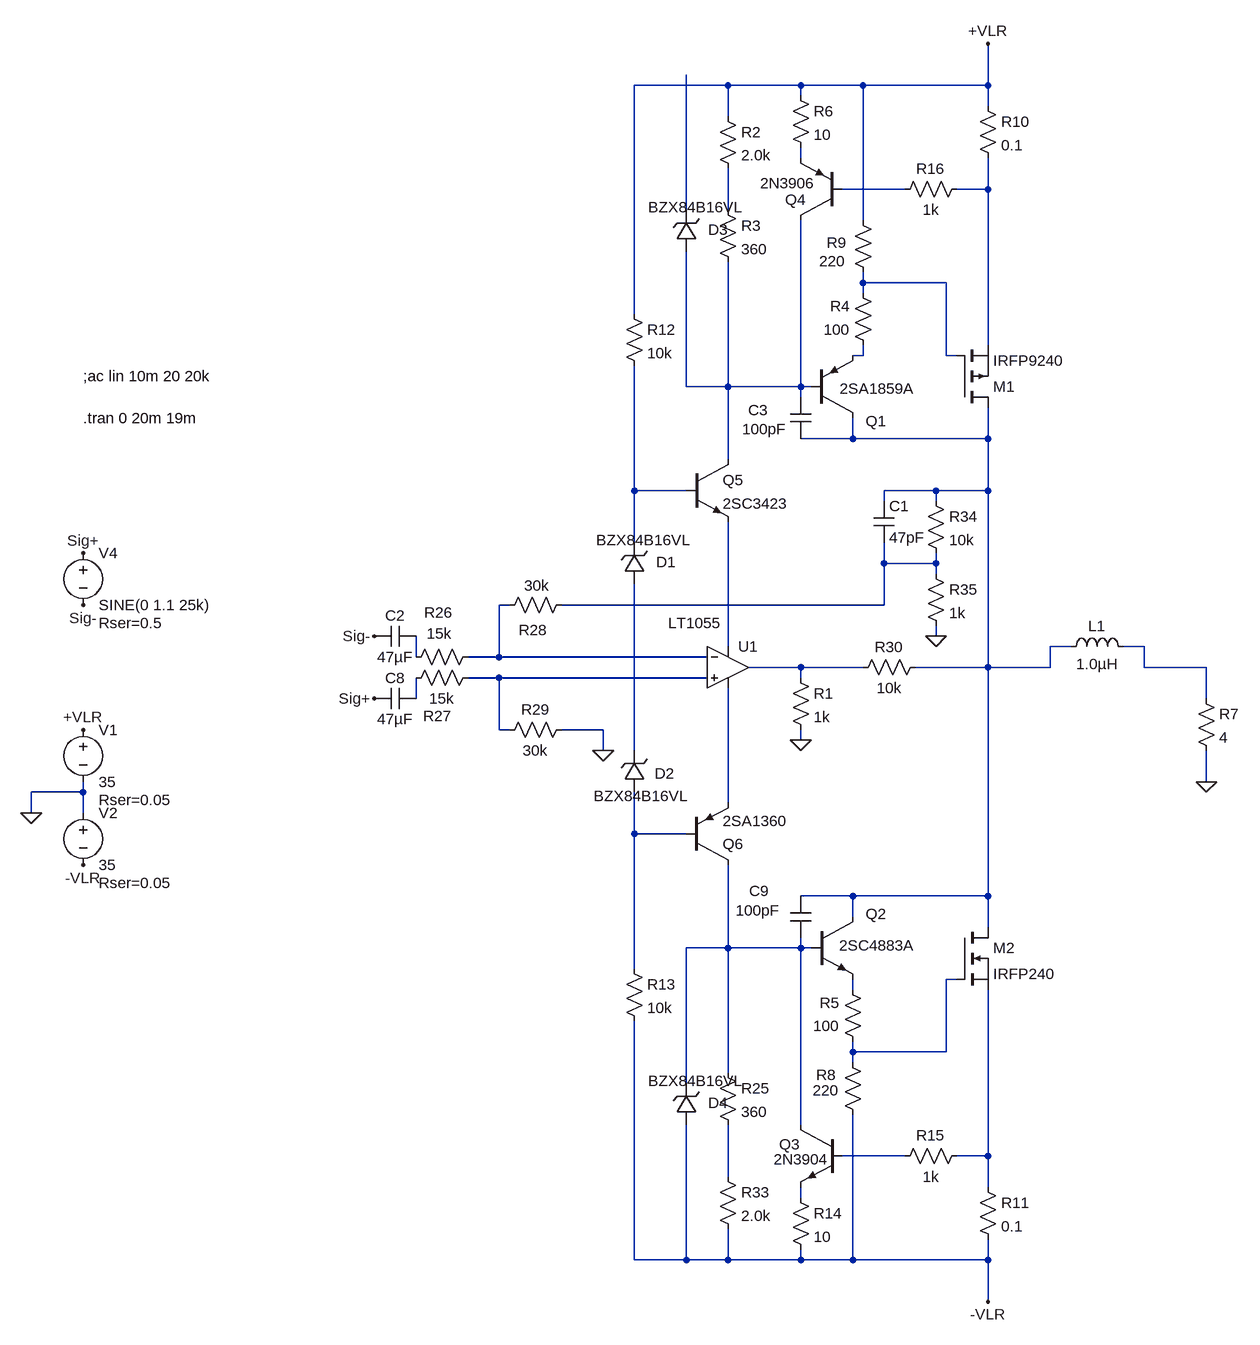
[diagram p0: schematic Feek FET Amp Final Low Power.asc]
Feek FET Amp Final Low Power.asc, the LTspice schematic file:
Version 4
SHEET 1 5268 2212
WIRE -1472 240 -1616 240
WIRE -1360 240 -1472 240
WIRE -1264 240 -1360 240
WIRE -1072 240 -1072 176
WIRE -1072 240 -1264 240
WIRE -1360 256 -1360 240
WIRE -1072 272 -1072 240
WIRE -1472 288 -1472 240
WIRE -1360 352 -1360 336
WIRE -1200 400 -1296 400
WIRE -1072 400 -1072 352
WIRE -1072 400 -1120 400
WIRE -1536 432 -1536 224
WIRE -1472 432 -1472 368
WIRE -1264 448 -1264 240
WIRE -1264 544 -1264 528
WIRE -1136 544 -1264 544
WIRE -1264 560 -1264 544
WIRE -1616 592 -1616 240
WIRE -1072 640 -1072 400
WIRE -1264 656 -1264 640
WIRE -1264 656 -1280 656
WIRE -1136 656 -1136 544
WIRE -1120 656 -1136 656
WIRE -1536 704 -1536 496
WIRE -1472 704 -1472 512
WIRE -1472 704 -1536 704
WIRE -1360 704 -1360 448
WIRE -1360 704 -1472 704
WIRE -1344 704 -1360 704
WIRE -1360 720 -1360 704
WIRE -1280 784 -1280 752
WIRE -1280 784 -1360 784
WIRE -1072 784 -1072 736
WIRE -1072 784 -1280 784
WIRE -1472 816 -1472 704
WIRE -1616 864 -1616 672
WIRE -1536 864 -1616 864
WIRE -1152 864 -1232 864
WIRE -1072 864 -1072 784
WIRE -1072 864 -1152 864
WIRE -1232 880 -1232 864
WIRE -1152 880 -1152 864
WIRE -1616 944 -1616 864
WIRE -1232 976 -1232 944
WIRE -1152 976 -1152 960
WIRE -1152 976 -1232 976
WIRE -1152 992 -1152 976
WIRE -1808 1040 -1824 1040
WIRE -1232 1040 -1232 976
WIRE -1232 1040 -1728 1040
WIRE -1152 1088 -1152 1072
WIRE -1472 1104 -1472 912
WIRE -944 1104 -976 1104
WIRE -832 1104 -864 1104
WIRE -1952 1120 -1952 1088
WIRE -1824 1120 -1824 1040
WIRE -1824 1120 -1872 1120
WIRE -1504 1120 -1824 1120
WIRE -1360 1136 -1440 1136
WIRE -1264 1136 -1360 1136
WIRE -1072 1136 -1072 864
WIRE -1072 1136 -1184 1136
WIRE -976 1136 -976 1104
WIRE -976 1136 -1072 1136
WIRE -832 1136 -832 1104
WIRE -736 1136 -832 1136
WIRE -1824 1152 -1872 1152
WIRE -1504 1152 -1824 1152
WIRE -1360 1152 -1360 1136
WIRE -1952 1184 -1952 1152
WIRE -736 1184 -736 1136
WIRE -1824 1232 -1824 1152
WIRE -1808 1232 -1824 1232
WIRE -1664 1232 -1728 1232
WIRE -1360 1248 -1360 1232
WIRE -1664 1264 -1664 1232
WIRE -1616 1264 -1616 1008
WIRE -736 1312 -736 1264
WIRE -2464 1328 -2464 1312
WIRE -2464 1328 -2544 1328
WIRE -1472 1344 -1472 1168
WIRE -2544 1360 -2544 1328
WIRE -2464 1360 -2464 1328
WIRE -1616 1392 -1616 1328
WIRE -1536 1392 -1616 1392
WIRE -1280 1488 -1360 1488
WIRE -1072 1488 -1072 1136
WIRE -1072 1488 -1280 1488
WIRE -1280 1520 -1280 1488
WIRE -1072 1536 -1072 1488
WIRE -1472 1568 -1472 1440
WIRE -1472 1568 -1536 1568
WIRE -1360 1568 -1360 1552
WIRE -1360 1568 -1472 1568
WIRE -1344 1568 -1360 1568
WIRE -1616 1600 -1616 1392
WIRE -1120 1616 -1136 1616
WIRE -1280 1632 -1280 1616
WIRE -1280 1728 -1280 1712
WIRE -1136 1728 -1136 1616
WIRE -1136 1728 -1280 1728
WIRE -1280 1744 -1280 1728
WIRE -1472 1760 -1472 1568
WIRE -1536 1776 -1536 1568
WIRE -1360 1840 -1360 1568
WIRE -1200 1888 -1296 1888
WIRE -1072 1888 -1072 1632
WIRE -1072 1888 -1120 1888
WIRE -1472 1920 -1472 1840
WIRE -1072 1936 -1072 1888
WIRE -1360 1952 -1360 1936
WIRE -1616 2048 -1616 1680
WIRE -1536 2048 -1536 1840
WIRE -1536 2048 -1616 2048
WIRE -1472 2048 -1472 2000
WIRE -1472 2048 -1536 2048
WIRE -1360 2048 -1360 2032
WIRE -1360 2048 -1472 2048
WIRE -1280 2048 -1280 1824
WIRE -1280 2048 -1360 2048
WIRE -1072 2048 -1072 2016
WIRE -1072 2048 -1280 2048
WIRE -1072 2112 -1072 2048
FLAG -736 1312 0
FLAG -2464 960 Sig+
FLAG -2464 1040 Sig-
FLAG -2464 1232 +VLR
FLAG -2464 1440 -VLR
FLAG -1664 1264 0
FLAG -2016 1088 Sig-
FLAG -2016 1184 Sig+
FLAG -1072 176 +VLR
FLAG -1072 2112 -VLR
FLAG -2544 1360 0
FLAG -1360 1248 0
FLAG -1152 1088 0
SYMBOL OpAmps\\LT1055 -1472 1072 R0
WINDOW 3 -92 -4 Left 2
SYMATTR InstName U1
SYMBOL pmos -1120 736 M180
SYMATTR InstName M1
SYMATTR Value IRFP9240
SYMBOL nmos -1120 1536 R0
SYMATTR InstName M2
SYMATTR Value IRFP240
SYMBOL res -752 1168 R0
SYMATTR InstName R7
SYMATTR Value 4
SYMBOL res -1088 256 R0
SYMATTR InstName R10
SYMATTR Value 0.1
SYMBOL res -1088 1920 R0
SYMATTR InstName R11
SYMATTR Value 0.1
SYMBOL npn -1536 816 R0
SYMATTR InstName Q5
SYMATTR Value 2SC3423
SYMBOL pnp -1536 1440 M180
SYMATTR InstName Q6
SYMATTR Value 2SA1360
SYMBOL zener -1600 1008 R180
WINDOW 0 -48 34 Left 2
WINDOW 3 -71 68 Left 2
SYMATTR InstName D1
SYMATTR Value BZX84B16VL
SYMBOL zener -1600 1328 R180
WINDOW 0 -46 29 Left 2
WINDOW 3 -67 -6 Left 2
SYMATTR InstName D2
SYMATTR Value BZX84B16VL
SYMBOL res -1632 576 R0
SYMATTR InstName R12
SYMATTR Value 10k
SYMBOL res -1632 1584 R0
SYMATTR InstName R13
SYMATTR Value 10k
SYMBOL pnp -1344 752 M180
WINDOW 0 84 -5 Left 2
WINDOW 3 44 45 Left 2
SYMATTR InstName Q1
SYMATTR Value 2SA1859A
SYMBOL npn -1344 1520 R0
WINDOW 0 84 -5 Left 2
WINDOW 3 43 44 Left 2
SYMATTR InstName Q2
SYMATTR Value 2SC4883A
SYMBOL res -1280 432 R0
WINDOW 0 -40 50 Left 2
WINDOW 3 -52 79 Left 2
SYMATTR InstName R9
SYMATTR Value 220
SYMBOL res -1296 1728 R0
WINDOW 0 -40 35 Left 2
WINDOW 3 -46 59 Left 2
SYMATTR InstName R8
SYMATTR Value 220
SYMBOL npn -1296 1840 M0
WINDOW 0 65 30 Left 2
WINDOW 3 21 53 Left 2
SYMATTR InstName Q3
SYMATTR Value 2N3904
SYMBOL res -1104 1872 R90
WINDOW 0 0 56 VBottom 2
WINDOW 3 32 56 VTop 2
SYMATTR InstName R15
SYMATTR Value 1k
SYMBOL pnp -1296 448 R180
WINDOW 3 42 57 Left 2
SYMATTR Value 2N3906
SYMATTR InstName Q4
SYMBOL res -1104 384 R90
WINDOW 0 0 56 VBottom 2
WINDOW 3 32 56 VTop 2
SYMATTR InstName R16
SYMATTR Value 1k
SYMBOL ind -960 1120 R270
WINDOW 0 32 56 VTop 2
WINDOW 3 5 56 VBottom 2
SYMATTR InstName L1
SYMATTR Value 1.0µH
SYMBOL voltage -2464 944 R0
WINDOW 39 24 124 Left 2
SYMATTR SpiceLine Rser=0.5
SYMATTR Value2 AC 1.0 0
SYMATTR InstName V4
SYMATTR Value SINE(0 1.1 25k)
SYMBOL res -1856 1104 R90
WINDOW 0 -37 61 VBottom 2
WINDOW 3 -36 60 VTop 2
SYMATTR InstName R26
SYMATTR Value 15k
SYMATTR SpiceLine tol=1
SYMBOL res -1856 1136 R90
WINDOW 0 90 63 VBottom 2
WINDOW 3 32 56 VTop 2
SYMATTR InstName R27
SYMATTR Value 15k
SYMATTR SpiceLine tol=1
SYMBOL res -1712 1024 R90
WINDOW 0 70 60 VBottom 2
WINDOW 3 -30 54 VTop 2
SYMATTR InstName R28
SYMATTR Value 30k
SYMATTR SpiceLine tol=1
SYMBOL res -1712 1216 R90
WINDOW 0 0 56 VBottom 2
WINDOW 3 32 56 VTop 2
SYMATTR InstName R29
SYMATTR Value 30k
SYMATTR SpiceLine tol=1
SYMBOL cap -1952 1072 R90
WINDOW 0 0 32 VBottom 2
WINDOW 3 32 32 VTop 2
SYMATTR InstName C2
SYMATTR Value 47µF
SYMBOL cap -1952 1168 R90
WINDOW 0 0 32 VBottom 2
WINDOW 3 32 32 VTop 2
SYMATTR InstName C8
SYMATTR Value 47µF
SYMBOL voltage -2464 1216 R0
WINDOW 123 0 0 Left 0
WINDOW 39 24 124 Left 2
SYMATTR SpiceLine Rser=0.05
SYMATTR InstName V1
SYMATTR Value 35
SYMBOL voltage -2464 1344 R0
WINDOW 123 0 0 Left 0
WINDOW 39 24 124 Left 2
SYMATTR SpiceLine Rser=0.05
SYMATTR InstName V2
SYMATTR Value 35
SYMBOL res -1488 272 R0
SYMATTR InstName R2
SYMATTR Value 2.0k
SYMBOL res -1488 1904 R0
SYMATTR InstName R33
SYMATTR Value 2.0k
SYMBOL res -1376 1136 R0
SYMATTR InstName R1
SYMATTR Value 1k
SYMBOL res -1168 864 R0
SYMATTR InstName R34
SYMATTR Value 10k
SYMBOL res -1168 976 R0
SYMATTR InstName R35
SYMATTR Value 1k
SYMBOL res -1248 656 R180
WINDOW 0 36 76 Left 2
WINDOW 3 36 40 Left 2
SYMATTR InstName R4
SYMATTR Value 100
SYMBOL res -1264 1728 R180
WINDOW 0 36 76 Left 2
WINDOW 3 36 40 Left 2
SYMATTR InstName R5
SYMATTR Value 100
SYMBOL res -1376 240 R0
SYMATTR InstName R6
SYMATTR Value 10
SYMBOL res -1376 1936 R0
SYMATTR InstName R14
SYMATTR Value 10
SYMBOL res -1488 416 R0
SYMATTR InstName R3
SYMATTR Value 360
SYMBOL res -1488 1744 R0
SYMATTR InstName R25
SYMATTR Value 360
SYMBOL res -1168 1120 R90
WINDOW 0 0 56 VBottom 2
WINDOW 3 32 56 VTop 2
SYMATTR InstName R30
SYMATTR Value 10k
SYMBOL cap -1248 880 R0
SYMATTR InstName C1
SYMATTR Value 47pF
SYMBOL cap -1376 720 R0
WINDOW 0 -65 20 Left 2
WINDOW 3 -74 49 Left 2
SYMATTR InstName C3
SYMATTR Value 100pF
SYMBOL cap -1376 1488 R0
WINDOW 0 -63 -8 Left 2
WINDOW 3 -84 22 Left 2
SYMATTR InstName C9
SYMATTR Value 100pF
SYMBOL zener -1520 496 R180
WINDOW 0 -48 34 Left 2
WINDOW 3 -71 68 Left 2
SYMATTR InstName D3
SYMATTR Value BZX84B16VL
SYMBOL zener -1520 1840 R180
WINDOW 0 -48 34 Left 2
WINDOW 3 -71 68 Left 2
SYMATTR InstName D4
SYMATTR Value BZX84B16VL
TEXT -2464 752 Left 2 !.tran 0 20m 19m
TEXT -2464 688 Left 2 !;ac lin 10m 20 20k

The netlist it stands for:
* Feek FET Amp Final Low Power.asc
XU1 N017 N012 N013 N020 N016 LT1055  ; pins In+ In- V+ V- OUT
M1 N009 N006 N003 N003 IRFP9240
M2 N009 N023 N026 N026 IRFP240
R7 N014 0 4
R10 +VLR N003 0.1
R11 N026 -VLR 0.1
Q5 N008 N010 N013 0 2SC3423
Q6 N022 N021 N020 0 2SA1360
D1 N019 N010 BZX84B16VL
D2 N021 N019 BZX84B16VL
R12 +VLR N010 10k
R13 N021 -VLR 10k
Q1 N009 N008 N007 0 2SA1859A
Q2 N009 N022 N024 0 2SC4883A
R9 +VLR N006 220
R8 N023 -VLR 220
Q3 N022 N025 N028 0 2N3904
R15 N026 N025 1k
Q4 N008 N002 N001 0 2N3906
R16 N003 N002 1k
L1 N009 N014 1.0µH
V4 Sig+ Sig- SINE(0 1.1 25k) AC 1.0 0 Rser=0.5
R26 N012 N015 15k tol=1
R27 N017 N018 15k tol=1
R28 N011 N012 30k tol=1
R29 0 N017 30k tol=1
C2 N015 Sig- 47µF
C8 N018 Sig+ 47µF
V1 +VLR 0 35 Rser=0.05
V2 0 -VLR 35 Rser=0.05
R2 +VLR N005 2.0k
R33 N027 -VLR 2.0k
R1 N016 0 1k
R34 N009 N011 10k
R35 N011 0 1k
R4 N007 N006 100
R5 N023 N024 100
R6 +VLR N001 10
R14 N028 -VLR 10
R3 N005 N008 360
R25 N022 N027 360
R30 N009 N016 10k
C1 N009 N011 47pF
C3 N008 N009 100pF
C9 N009 N022 100pF
D3 N008 N004 BZX84B16VL
D4 -VLR N022 BZX84B16VL
.model D D
.lib standard.dio
.model NPN NPN
.model PNP PNP
.lib standard.bjt
.model NMOS NMOS
.model PMOS PMOS
.lib standard.mos
.tran 0 20m 19m
;ac lin 10m 20 20k
.backanno
.end